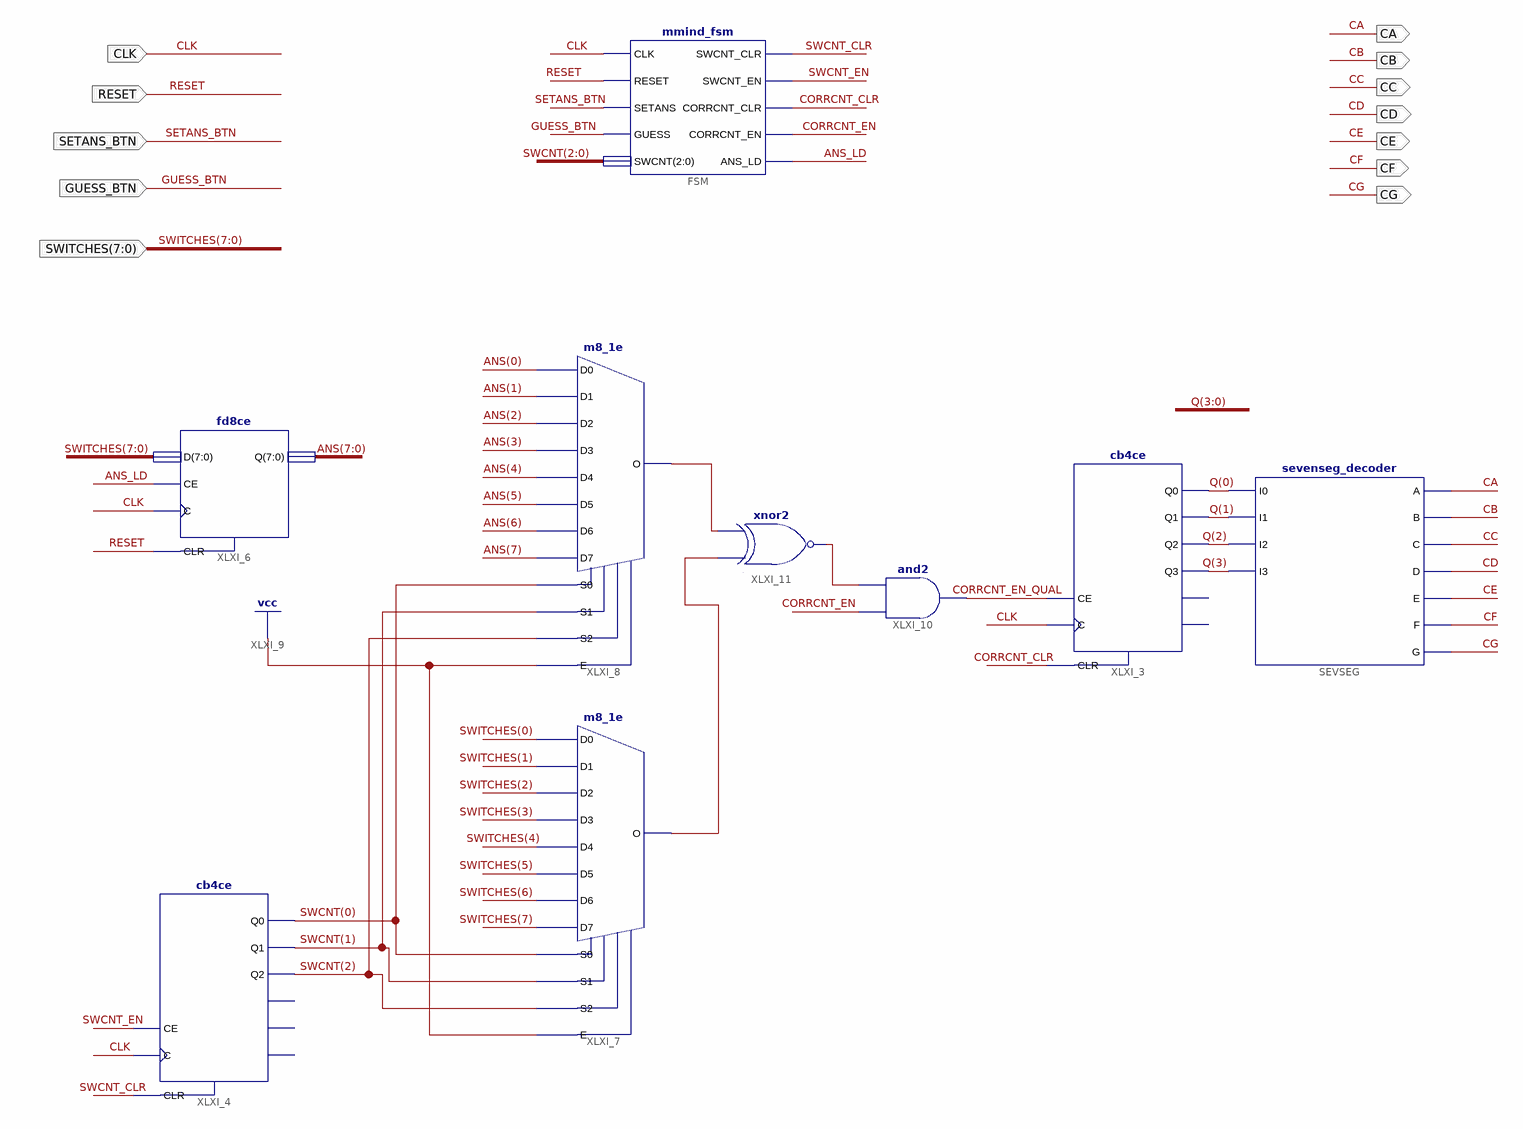
[diagram p0: schematic sheet 1]
// Xilinx ISE schematic mmind.sch (spartan3e) as structural Verilog: 9 symbols, 12 ports
module mmind (
  input  CLK,
  input  RESET,
  input  SETANS_BTN,
  input  GUESS_BTN,
  input  [7:0] SWITCHES,
  output CA,
  output CB,
  output CC,
  output CD,
  output CE,
  output CF,
  output CG
);

  wire ANS_LD, CORRCNT_CLR, CORRCNT_EN, CORRCNT_EN_QUAL, SWCNT_CLR, SWCNT_EN, XLXN_87, XLXN_88, XLXN_89;
  wire [2:0] SWCNT;
  wire [3:0] Q;
  wire [7:0] ANS;

  mmind_fsm FSM (
    .CLK(CLK), .RESET(RESET), .SETANS(SETANS_BTN), .GUESS(GUESS_BTN), .SWCNT(SWCNT), .SWCNT_CLR(SWCNT_CLR),
    .SWCNT_EN(SWCNT_EN), .CORRCNT_CLR(CORRCNT_CLR), .CORRCNT_EN(CORRCNT_EN), .ANS_LD(ANS_LD));
  cb4ce XLXI_3 (
    .C(CLK), .CE(CORRCNT_EN_QUAL), .CLR(CORRCNT_CLR), .Q0(Q[0]), .Q1(Q[1]), .Q2(Q[2]), .Q3(Q[3]));  // open: CEO, TC
  cb4ce XLXI_4 (
    .C(CLK), .CE(SWCNT_EN), .CLR(SWCNT_CLR), .Q0(SWCNT[0]), .Q1(SWCNT[1]), .Q2(SWCNT[2]));  // open: CEO, Q3, TC
  fd8ce XLXI_6 (.C(CLK), .CE(ANS_LD), .CLR(RESET), .D(SWITCHES), .Q(ANS));
  m8_1e XLXI_7 (
    .D0(SWITCHES[0]), .D1(SWITCHES[1]), .D2(SWITCHES[2]), .D3(SWITCHES[3]), .D4(SWITCHES[4]),
    .D5(SWITCHES[5]), .D6(SWITCHES[6]), .D7(SWITCHES[7]), .E(1'b1), .S0(SWCNT[0]), .S1(SWCNT[1]),
    .S2(SWCNT[2]), .O(XLXN_88));
  m8_1e XLXI_8 (
    .D0(ANS[0]), .D1(ANS[1]), .D2(ANS[2]), .D3(ANS[3]), .D4(ANS[4]), .D5(ANS[5]), .D6(ANS[6]), .D7(ANS[7]),
    .E(1'b1), .S0(SWCNT[0]), .S1(SWCNT[1]), .S2(SWCNT[2]), .O(XLXN_87));
  and XLXI_10 (CORRCNT_EN_QUAL, CORRCNT_EN, XLXN_89);
  xnor XLXI_11 (XLXN_89, XLXN_88, XLXN_87);
  sevenseg_decoder SEVSEG (
    .I0(Q[0]), .I1(Q[1]), .I2(Q[2]), .I3(Q[3]), .A(CA), .B(CB), .C(CC), .E(CE), .D(CD), .F(CF), .G(CG));
endmodule
